# EAGLE schematic regulator_plus_switch_multi (EAGLE 7.2.0)
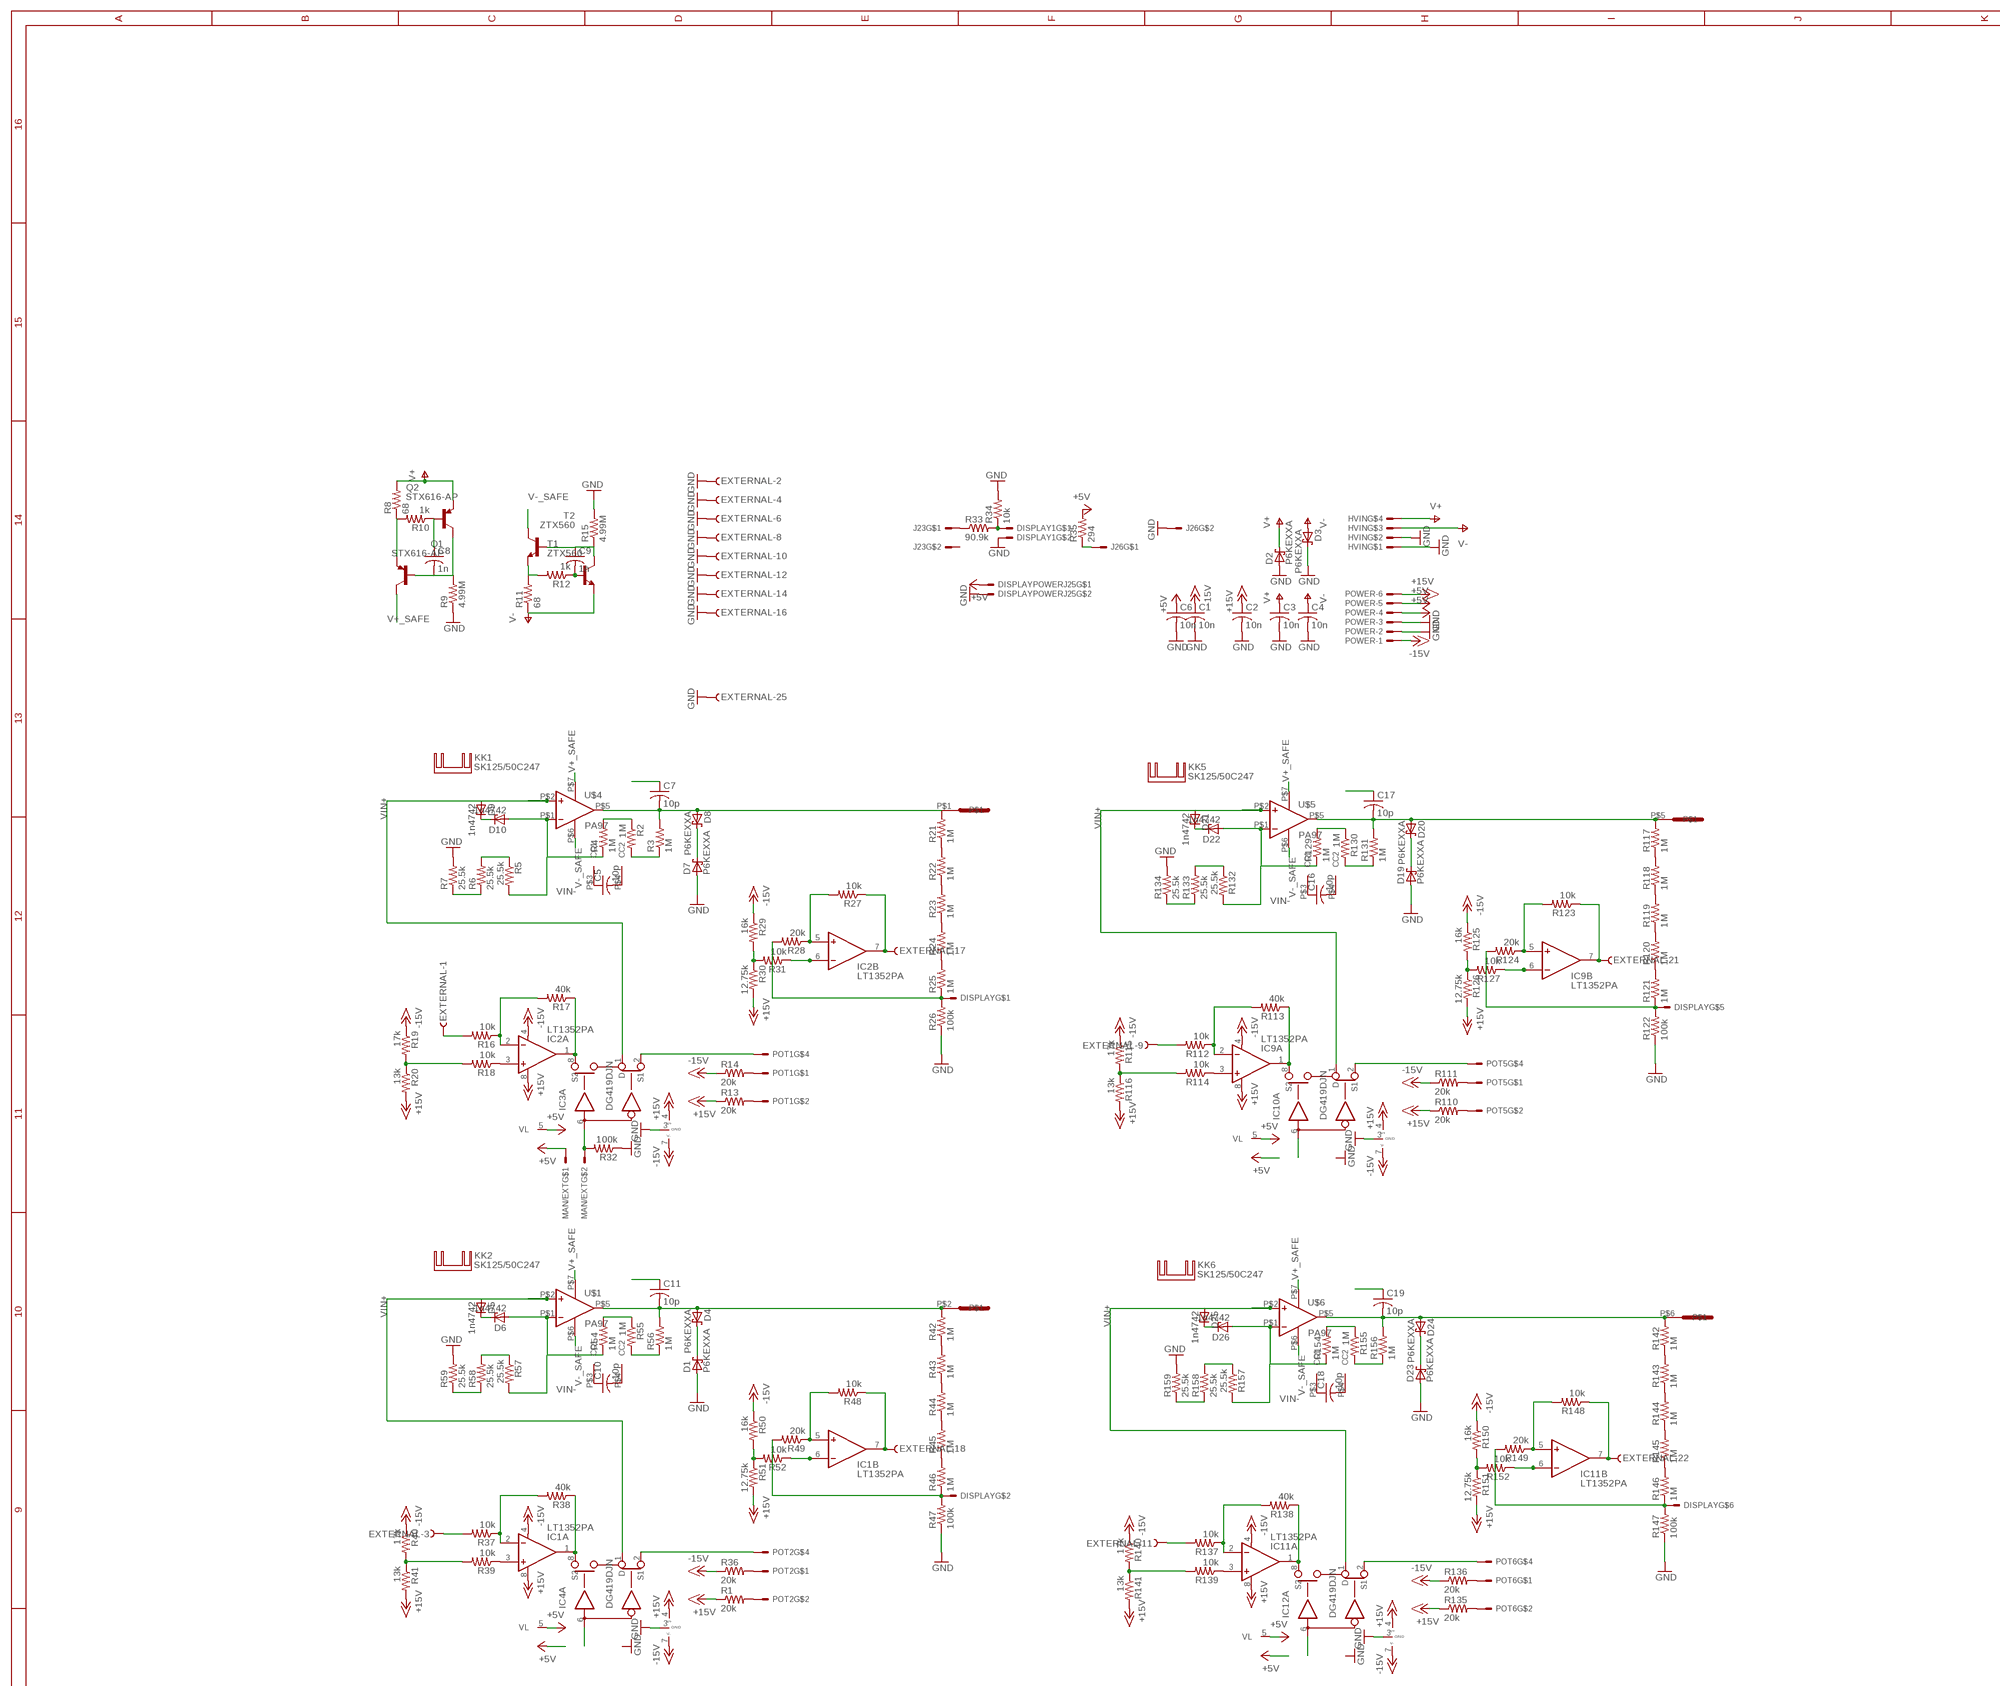
[diagram p0: schematic, sheet 1, part 1 of 2]
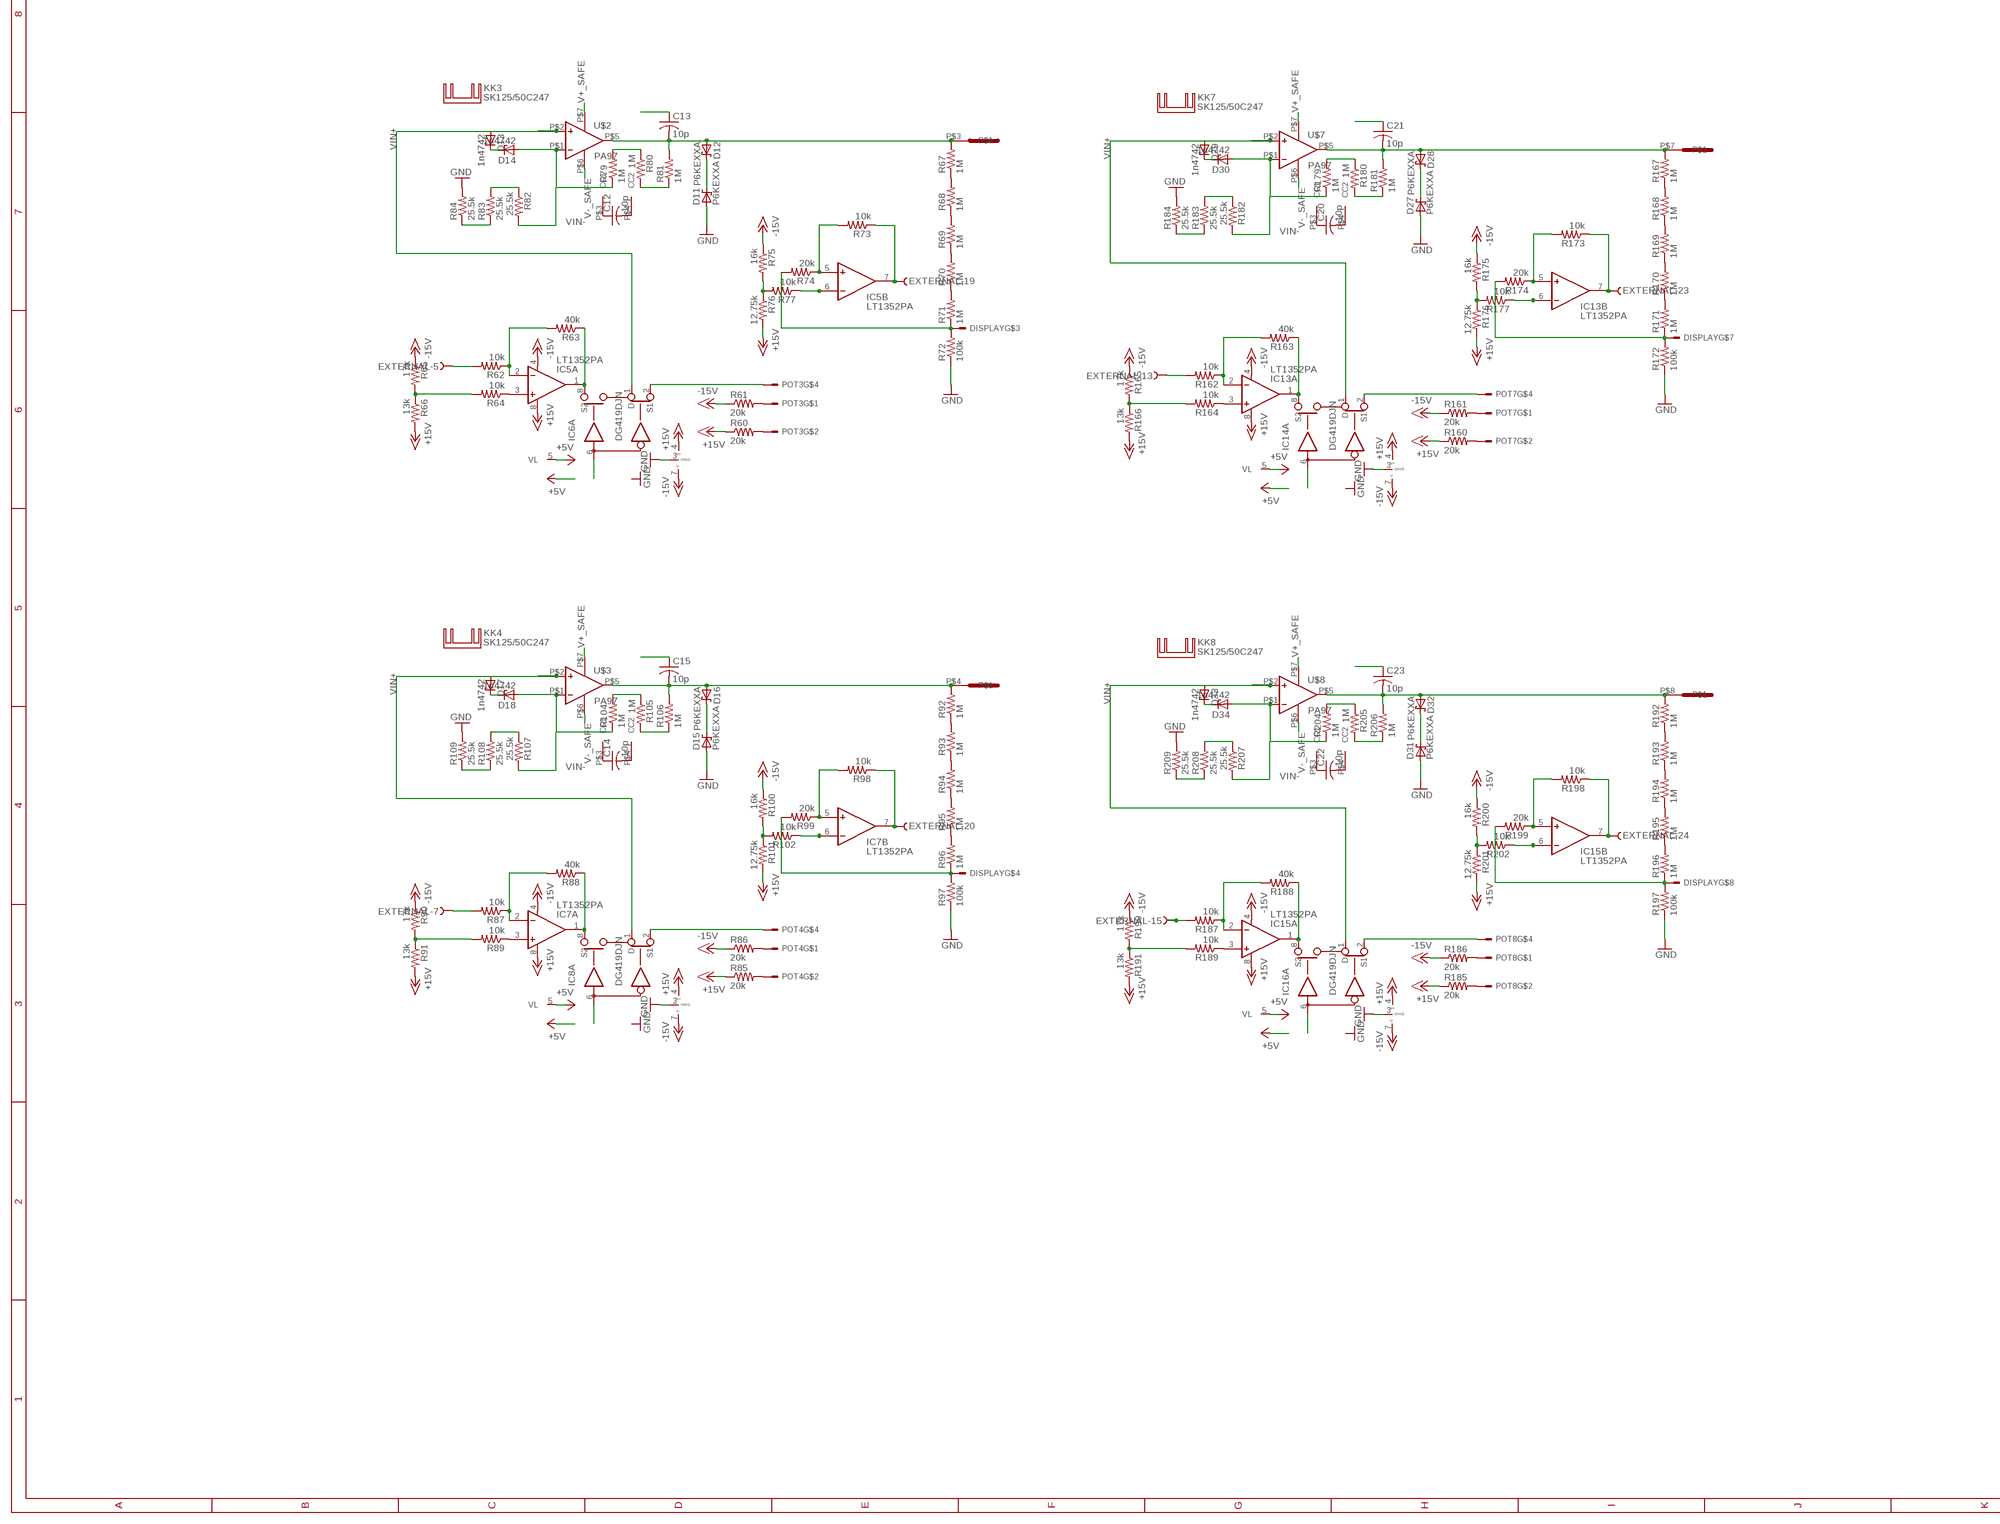
[diagram p1: schematic, sheet 1, part 2 of 2]

## Parts
C1  10n  C-US075-032X103  [C075-032X103]
C2  10n  C-US075-032X103  [C075-032X103]
C3  10n  C-US075-032X103  [C075-032X103]
C4  10n  C-US075-032X103  [C075-032X103]
C5  10p  C-US075-032X103  [C075-032X103]
C6  10n  C-US075-032X103  [C075-032X103]
C7  10p  C-US075-032X103  [C075-032X103]
C8  1n  C-US075-032X103  [C075-032X103]
C9  1n  C-US075-032X103  [C075-032X103]
C10  10p  C-US075-032X103  [C075-032X103]
C11  10p  C-US075-032X103  [C075-032X103]
C12  10p  C-US075-032X103  [C075-032X103]
C13  10p  C-US075-032X103  [C075-032X103]
C14  10p  C-US075-032X103  [C075-032X103]
C15  10p  C-US075-032X103  [C075-032X103]
C16  10p  C-US075-032X103  [C075-032X103]
C17  10p  C-US075-032X103  [C075-032X103]
C18  10p  C-US075-032X103  [C075-032X103]
C19  10p  C-US075-032X103  [C075-032X103]
C20  10p  C-US075-032X103  [C075-032X103]
C21  10p  C-US075-032X103  [C075-032X103]
C22  10p  C-US075-032X103  [C075-032X103]
C23  10p  C-US075-032X103  [C075-032X103]
D1  P6KEXXA  [C1702-15]
D2  P6KEXXA  [C1702-15]
D3  P6KEXXA  [C1702-15]
D4  P6KEXXA  [C1702-15]
D5  1n4742  ZENER-DIODEDO41Z10  [DO41Z10]
D6  1n4742  ZENER-DIODEDO41Z10  [DO41Z10]
D7  P6KEXXA  [C1702-15]
D8  P6KEXXA  [C1702-15]
D9  1n4742  ZENER-DIODEDO41Z10  [DO41Z10]
D10  1n4742  ZENER-DIODEDO41Z10  [DO41Z10]
D11  P6KEXXA  [C1702-15]
D12  P6KEXXA  [C1702-15]
D13  1n4742  ZENER-DIODEDO41Z10  [DO41Z10]
D14  1n4742  ZENER-DIODEDO41Z10  [DO41Z10]
D15  P6KEXXA  [C1702-15]
D16  P6KEXXA  [C1702-15]
D17  1n4742  ZENER-DIODEDO41Z10  [DO41Z10]
D18  1n4742  ZENER-DIODEDO41Z10  [DO41Z10]
D19  P6KEXXA  [C1702-15]
D20  P6KEXXA  [C1702-15]
D21  1n4742  ZENER-DIODEDO41Z10  [DO41Z10]
D22  1n4742  ZENER-DIODEDO41Z10  [DO41Z10]
D23  P6KEXXA  [C1702-15]
D24  P6KEXXA  [C1702-15]
D25  1n4742  ZENER-DIODEDO41Z10  [DO41Z10]
D26  1n4742  ZENER-DIODEDO41Z10  [DO41Z10]
D27  P6KEXXA  [C1702-15]
D28  P6KEXXA  [C1702-15]
D29  1n4742  ZENER-DIODEDO41Z10  [DO41Z10]
D30  1n4742  ZENER-DIODEDO41Z10  [DO41Z10]
D31  P6KEXXA  [C1702-15]
D32  P6KEXXA  [C1702-15]
D33  1n4742  ZENER-DIODEDO41Z10  [DO41Z10]
D34  1n4742  ZENER-DIODEDO41Z10  [DO41Z10]
DISPLAY  5669-8  [5669-8]
DISPLAY1  5569-2  [5569-2]
DISPLAYPOWERJ25  5569-2  [5569-2]
EXTERNAL  F25HPS  [F25HP]
HVIN  5569-4  [5669-4]
IC1  LT1352PA  [DIL08]
IC2  LT1352PA  [DIL08]
IC3  DG419DJN  [DIL08]
IC4  DG419DJN  [DIL08]
IC5  LT1352PA  [DIL08]
IC6  DG419DJN  [DIL08]
IC7  LT1352PA  [DIL08]
IC8  DG419DJN  [DIL08]
IC9  LT1352PA  [DIL08]
IC10  DG419DJN  [DIL08]
IC11  LT1352PA  [DIL08]
IC12  DG419DJN  [DIL08]
IC13  LT1352PA  [DIL08]
IC14  DG419DJN  [DIL08]
IC15  LT1352PA  [DIL08]
IC16  DG419DJN  [DIL08]
J23  5569-2  [5569-2]
J26  5569-2  [5569-2]
KK1  SK125/50C247  [C247-050]
KK2  SK125/50C247  [C247-050]
KK3  SK125/50C247  [C247-050]
KK4  SK125/50C247  [C247-050]
KK5  SK125/50C247  [C247-050]
KK6  SK125/50C247  [C247-050]
KK7  SK125/50C247  [C247-050]
KK8  SK125/50C247  [C247-050]
MAN/EXT  5569-2  [5569-2]
OUT  640584-1  [640584-1]
POT1  5569-4  [5669-4]
POT2  5569-4  [5669-4]
POT3  5569-4  [5669-4]
POT4  5569-4  [5669-4]
POT5  5569-4  [5669-4]
POT6  5569-4  [5669-4]
POT7  5569-4  [5669-4]
POT8  5569-4  [5669-4]
POWER  KK-156-6  [KK-156-6]
Q1  STX616-AP  2N3906  [TO92]
Q2  STX616-AP  2N3906  [TO92]
R1  20k  R-US_0207/10  [0207/10]
R2  1M  R-US_0207/10  [0207/10]
R3  1M  R-US_0207/10  [0207/10]
R4  1M  R-US_0207/10  [0207/10]
R5  25.5k  R-US_0207/10  [0207/10]
R6  25.5k  R-US_0207/10  [0207/10]
R7  25.5k  R-US_0207/10  [0207/10]
R8  68  R-US_0207/10  [0207/10]
R9  4.99M  R-US_0207/10  [0207/10]
R10  1k  R-US_0207/10  [0207/10]
R11  68  R-US_0207/10  [0207/10]
R12  1k  R-US_0207/10  [0207/10]
R13  20k  R-US_0207/10  [0207/10]
R14  20k  R-US_0207/10  [0207/10]
R15  4.99M  R-US_0207/10  [0207/10]
R16  10k  R-US_0207/10  [0207/10]
R17  40k  R-US_0207/10  [0207/10]
R18  10k  R-US_0207/10  [0207/10]
R19  17k  R-US_0207/10  [0207/10]
R20  13k  R-US_0207/10  [0207/10]
R21  1M  R-US_0207/10  [0207/10]
R22  1M  R-US_0207/10  [0207/10]
R23  1M  R-US_0207/10  [0207/10]
R24  1M  R-US_0207/10  [0207/10]
R25  1M  R-US_0207/10  [0207/10]
R26  100k  R-US_0207/10  [0207/10]
R27  10k  R-US_0207/10  [0207/10]
R28  20k  R-US_0207/10  [0207/10]
R29  16k  R-US_0207/10  [0207/10]
R30  12.75k  R-US_0207/10  [0207/10]
R31  10k  R-US_0207/10  [0207/10]
R32  100k  R-US_0207/10  [0207/10]
R33  90.9k  R-US_0207/10  [0207/10]
R34  10k  R-US_0207/10  [0207/10]
R35  294  R-US_0207/10  [0207/10]
R36  20k  R-US_0207/10  [0207/10]
R37  10k  R-US_0207/10  [0207/10]
R38  40k  R-US_0207/10  [0207/10]
R39  10k  R-US_0207/10  [0207/10]
R40  17k  R-US_0207/10  [0207/10]
R41  13k  R-US_0207/10  [0207/10]
R42  1M  R-US_0207/10  [0207/10]
R43  1M  R-US_0207/10  [0207/10]
R44  1M  R-US_0207/10  [0207/10]
R45  1M  R-US_0207/10  [0207/10]
R46  1M  R-US_0207/10  [0207/10]
R47  100k  R-US_0207/10  [0207/10]
R48  10k  R-US_0207/10  [0207/10]
R49  20k  R-US_0207/10  [0207/10]
R50  16k  R-US_0207/10  [0207/10]
R51  12.75k  R-US_0207/10  [0207/10]
R52  10k  R-US_0207/10  [0207/10]
R54  1M  R-US_0207/10  [0207/10]
R55  1M  R-US_0207/10  [0207/10]
R56  1M  R-US_0207/10  [0207/10]
R57  25.5k  R-US_0207/10  [0207/10]
R58  25.5k  R-US_0207/10  [0207/10]
R59  25.5k  R-US_0207/10  [0207/10]
R60  20k  R-US_0207/10  [0207/10]
R61  20k  R-US_0207/10  [0207/10]
R62  10k  R-US_0207/10  [0207/10]
R63  40k  R-US_0207/10  [0207/10]
R64  10k  R-US_0207/10  [0207/10]
R65  17k  R-US_0207/10  [0207/10]
R66  13k  R-US_0207/10  [0207/10]
R67  1M  R-US_0207/10  [0207/10]
R68  1M  R-US_0207/10  [0207/10]
R69  1M  R-US_0207/10  [0207/10]
R70  1M  R-US_0207/10  [0207/10]
R71  1M  R-US_0207/10  [0207/10]
R72  100k  R-US_0207/10  [0207/10]
R73  10k  R-US_0207/10  [0207/10]
R74  20k  R-US_0207/10  [0207/10]
R75  16k  R-US_0207/10  [0207/10]
R76  12.75k  R-US_0207/10  [0207/10]
R77  10k  R-US_0207/10  [0207/10]
R79  1M  R-US_0207/10  [0207/10]
R80  1M  R-US_0207/10  [0207/10]
R81  1M  R-US_0207/10  [0207/10]
R82  25.5k  R-US_0207/10  [0207/10]
R83  25.5k  R-US_0207/10  [0207/10]
R84  25.5k  R-US_0207/10  [0207/10]
R85  20k  R-US_0207/10  [0207/10]
R86  20k  R-US_0207/10  [0207/10]
R87  10k  R-US_0207/10  [0207/10]
R88  40k  R-US_0207/10  [0207/10]
R89  10k  R-US_0207/10  [0207/10]
R90  17k  R-US_0207/10  [0207/10]
R91  13k  R-US_0207/10  [0207/10]
R92  1M  R-US_0207/10  [0207/10]
R93  1M  R-US_0207/10  [0207/10]
R94  1M  R-US_0207/10  [0207/10]
R95  1M  R-US_0207/10  [0207/10]
R96  1M  R-US_0207/10  [0207/10]
R97  100k  R-US_0207/10  [0207/10]
R98  10k  R-US_0207/10  [0207/10]
R99  20k  R-US_0207/10  [0207/10]
R100  16k  R-US_0207/10  [0207/10]
R101  12.75k  R-US_0207/10  [0207/10]
R102  10k  R-US_0207/10  [0207/10]
R104  1M  R-US_0207/10  [0207/10]
R105  1M  R-US_0207/10  [0207/10]
R106  1M  R-US_0207/10  [0207/10]
R107  25.5k  R-US_0207/10  [0207/10]
R108  25.5k  R-US_0207/10  [0207/10]
R109  25.5k  R-US_0207/10  [0207/10]
R110  20k  R-US_0207/10  [0207/10]
R111  20k  R-US_0207/10  [0207/10]
R112  10k  R-US_0207/10  [0207/10]
R113  40k  R-US_0207/10  [0207/10]
R114  10k  R-US_0207/10  [0207/10]
R115  17k  R-US_0207/10  [0207/10]
R116  13k  R-US_0207/10  [0207/10]
R117  1M  R-US_0207/10  [0207/10]
R118  1M  R-US_0207/10  [0207/10]
R119  1M  R-US_0207/10  [0207/10]
R120  1M  R-US_0207/10  [0207/10]
R121  1M  R-US_0207/10  [0207/10]
R122  100k  R-US_0207/10  [0207/10]
R123  10k  R-US_0207/10  [0207/10]
R124  20k  R-US_0207/10  [0207/10]
R125  16k  R-US_0207/10  [0207/10]
R126  12.75k  R-US_0207/10  [0207/10]
R127  10k  R-US_0207/10  [0207/10]
R129  1M  R-US_0207/10  [0207/10]
R130  1M  R-US_0207/10  [0207/10]
R131  1M  R-US_0207/10  [0207/10]
R132  25.5k  R-US_0207/10  [0207/10]
R133  25.5k  R-US_0207/10  [0207/10]
R134  25.5k  R-US_0207/10  [0207/10]
R135  20k  R-US_0207/10  [0207/10]
R136  20k  R-US_0207/10  [0207/10]
R137  10k  R-US_0207/10  [0207/10]
R138  40k  R-US_0207/10  [0207/10]
R139  10k  R-US_0207/10  [0207/10]
R140  17k  R-US_0207/10  [0207/10]
R141  13k  R-US_0207/10  [0207/10]
R142  1M  R-US_0207/10  [0207/10]
R143  1M  R-US_0207/10  [0207/10]
R144  1M  R-US_0207/10  [0207/10]
R145  1M  R-US_0207/10  [0207/10]
R146  1M  R-US_0207/10  [0207/10]
R147  100k  R-US_0207/10  [0207/10]
R148  10k  R-US_0207/10  [0207/10]
R149  20k  R-US_0207/10  [0207/10]
R150  16k  R-US_0207/10  [0207/10]
R151  12.75k  R-US_0207/10  [0207/10]
R152  10k  R-US_0207/10  [0207/10]
R154  1M  R-US_0207/10  [0207/10]
R155  1M  R-US_0207/10  [0207/10]
R156  1M  R-US_0207/10  [0207/10]
R157  25.5k  R-US_0207/10  [0207/10]
R158  25.5k  R-US_0207/10  [0207/10]
R159  25.5k  R-US_0207/10  [0207/10]
R160  20k  R-US_0207/10  [0207/10]
R161  20k  R-US_0207/10  [0207/10]
R162  10k  R-US_0207/10  [0207/10]
R163  40k  R-US_0207/10  [0207/10]
R164  10k  R-US_0207/10  [0207/10]
R165  17k  R-US_0207/10  [0207/10]
R166  13k  R-US_0207/10  [0207/10]
R167  1M  R-US_0207/10  [0207/10]
R168  1M  R-US_0207/10  [0207/10]
R169  1M  R-US_0207/10  [0207/10]
R170  1M  R-US_0207/10  [0207/10]
R171  1M  R-US_0207/10  [0207/10]
R172  100k  R-US_0207/10  [0207/10]
R173  10k  R-US_0207/10  [0207/10]
R174  20k  R-US_0207/10  [0207/10]
R175  16k  R-US_0207/10  [0207/10]
R176  12.75k  R-US_0207/10  [0207/10]
R177  10k  R-US_0207/10  [0207/10]
R179  1M  R-US_0207/10  [0207/10]
R180  1M  R-US_0207/10  [0207/10]
R181  1M  R-US_0207/10  [0207/10]
R182  25.5k  R-US_0207/10  [0207/10]
R183  25.5k  R-US_0207/10  [0207/10]
R184  25.5k  R-US_0207/10  [0207/10]
R185  20k  R-US_0207/10  [0207/10]
R186  20k  R-US_0207/10  [0207/10]
R187  10k  R-US_0207/10  [0207/10]
R188  40k  R-US_0207/10  [0207/10]
R189  10k  R-US_0207/10  [0207/10]
R190  17k  R-US_0207/10  [0207/10]
R191  13k  R-US_0207/10  [0207/10]
R192  1M  R-US_0207/10  [0207/10]
R193  1M  R-US_0207/10  [0207/10]
R194  1M  R-US_0207/10  [0207/10]
R195  1M  R-US_0207/10  [0207/10]
R196  1M  R-US_0207/10  [0207/10]
R197  100k  R-US_0207/10  [0207/10]
R198  10k  R-US_0207/10  [0207/10]
R199  20k  R-US_0207/10  [0207/10]
R200  16k  R-US_0207/10  [0207/10]
R201  12.75k  R-US_0207/10  [0207/10]
R202  10k  R-US_0207/10  [0207/10]
R204  1M  R-US_0207/10  [0207/10]
R205  1M  R-US_0207/10  [0207/10]
R206  1M  R-US_0207/10  [0207/10]
R207  25.5k  R-US_0207/10  [0207/10]
R208  25.5k  R-US_0207/10  [0207/10]
R209  25.5k  R-US_0207/10  [0207/10]
T1  ZTX560  2N3904  [TO92]
T2  ZTX560  2N3904  [TO92]
U$1  PA97  [7SIP]
U$2  PA97  [7SIP]
U$3  PA97  [7SIP]
U$4  PA97  [7SIP]
U$5  PA97  [7SIP]
U$6  PA97  [7SIP]
U$7  PA97  [7SIP]
U$8  PA97  [7SIP]

## Nets
+5V [power]: C6.1 DISPLAYPOWERJ25.P$1 IC3.5(VL:VL) IC4.5(VL:VL) IC6.5(VL:VL) IC8.5(VL:VL) IC10.5(VL:VL) IC12.5(VL:VL) IC14.5(VL:VL) IC16.5(VL:VL) MAN/EXT.P$1 POWER.4 POWER.5 R35.2
+15V [power]: C2.1 IC1.8(A:V+) IC2.8(A:V+) IC3.4(P:V+) IC4.4(P:V+) IC5.8(A:V+) IC6.4(P:V+) IC7.8(A:V+) IC8.4(P:V+) IC9.8(A:V+) IC10.4(P:V+) IC11.8(A:V+) IC12.4(P:V+) IC13.8(A:V+) IC14.4(P:V+) IC15.8(A:V+) IC16.4(P:V+) POWER.6 R1.1 R13.1 R20.2 R30.2 R41.2 R51.2 R60.1 R66.2 R76.2 R85.1 R91.2 R101.2 R110.1 R116.2 R126.2 R135.1 R141.2 R151.2 R160.1 R166.2 R176.2 R185.1 R191.2 R201.2
-15V [power]: C1.1 IC1.4(A:V-) IC2.4(A:V-) IC3.7(P:V-) IC4.7(P:V-) IC5.4(A:V-) IC6.7(P:V-) IC7.4(A:V-) IC8.7(P:V-) IC9.4(A:V-) IC10.7(P:V-) IC11.4(A:V-) IC12.7(P:V-) IC13.4(A:V-) IC14.7(P:V-) IC15.4(A:V-) IC16.7(P:V-) POWER.1 R14.1 R19.1 R29.1 R36.1 R40.1 R50.1 R61.1 R65.1 R75.1 R86.1 R90.1 R100.1 R111.1 R115.1 R125.1 R136.1 R140.1 R150.1 R161.1 R165.1 R175.1 R186.1 R190.1 R200.1
CMD1: EXTERNAL.1 R16.2
CMD2: EXTERNAL.3 R37.2
CMD3: EXTERNAL.5 R62.2
CMD4: EXTERNAL.7 R87.2
CMD5: EXTERNAL.9 R112.2
CMD6: EXTERNAL.11 R137.2
CMD7: EXTERNAL.13 R162.2
CMD8: EXTERNAL.15 R187.2
GND [ground]: C1.2 C2.2 C3.2 C4.2 C6.2 D1.A D2.A D3.C D7.A D11.A D15.A D19.A D23.A D27.A D31.A DISPLAY1.P$2 DISPLAYPOWERJ25.P$2 EXTERNAL.2 EXTERNAL.4 EXTERNAL.6 EXTERNAL.8 EXTERNAL.10 EXTERNAL.12 EXTERNAL.14 EXTERNAL.16 EXTERNAL.25 HVIN.P$1 HVIN.P$2 IC3.3(P:GND) IC4.3(P:GND) IC6.3(P:GND) IC8.3(P:GND) IC10.3(P:GND) IC12.3(P:GND) IC14.3(P:GND) IC16.3(P:GND) J26.P$2 POWER.2 POWER.3 R7.2 R9.1 R15.2 R26.1 R32.1 R34.2 R47.1 R59.2 R72.1 R84.2 R97.1 R109.2 R122.1 R134.2 R147.1 R159.2 R172.1 R184.2 R197.1 R209.2
MAN: IC3.6(A:IN) IC4.6(A:IN) IC6.6(A:IN) IC8.6(A:IN) IC10.6(A:IN) IC12.6(A:IN) IC14.6(A:IN) IC16.6(A:IN) MAN/EXT.P$2 R32.2
N$1: R11.2 R12.2 T2.3(E)
N$2: C8.1 Q2.2(B) R10.1
N$3: C5.1 U$4.P$3(CC1)
N$4: C5.2 U$4.P$4(CC2)
N$5: Q1.3(E) R8.1 R10.2
N$6: IC1.2(A:-IN) R37.1 R38.2
N$7: IC1.3(A:+IN) R39.1
N$8: D7.C D8.C
N$9: POT1.P$2 R13.2
N$10: C8.2 Q1.2(B) Q2.1(C) R9.2
N$11 [power]: C7.2 D8.A OUT.P$1 R3.2 R21.2 U$4.P$5(OUT)
N$12: R2.1 R4.2
N$13: IC3.2(A:S1) POT1.P$4
N$14: R5.1 R6.2
N$15: POT1.P$1 R14.2
N$16: R6.1 R7.1
N$17: C9.2 R12.1 T1.2(B)
N$18: R2.2 R3.1
N$19: C9.1 R15.1 T1.1(C) T2.2(B)
N$20: DISPLAY1.P$1 R33.2 R34.1
N$21: J23.P$1 R33.1
N$22: J26.P$1 R35.1
N$23: R39.2 R40.2 R41.1
N$24: IC2.2(A:-IN) R16.1 R17.2
N$25: IC2.3(A:+IN) R18.1
N$26: R18.2 R19.2 R20.1
N$27: IC2.1(A:OUT) IC3.8(A:S2) R17.1
N$28: IC1.1(A:OUT) IC4.8(A:S2) R38.1
N$29: D9.C D10.C
N$30: R21.1 R22.2
N$31: R22.1 R23.2
N$32: R23.1 R24.2
N$33: R24.1 R25.2
N$34: DISPLAY.P$1 R25.1 R26.2 R28.2
N$35: EXTERNAL.17 IC2.7(B:OUT) R27.1
N$36: R29.2 R30.1 R31.2
N$37: IC2.6(B:-IN) R31.1
N$38: R42.1 R43.2
N$39: IC2.5(B:+IN) R27.2 R28.1
N$40: R43.1 R44.2
N$41: R44.1 R45.2
N$42: R45.1 R46.2
N$43: DISPLAY.P$2 R46.1 R47.2 R49.2
N$44: EXTERNAL.18 IC1.7(B:OUT) R48.1
N$45: R50.2 R51.1 R52.2
N$46: IC1.6(B:-IN) R52.1
N$47: IC1.5(B:+IN) R48.2 R49.1
N$48: POT2.P$2 R1.2
N$49: IC4.2(A:S1) POT2.P$4
N$50: POT2.P$1 R36.2
N$51: C10.1 U$1.P$3(CC1)
N$52: C10.2 U$1.P$4(CC2)
N$53 [power]: C11.2 D4.A OUT.P$2 R42.2 R56.2 U$1.P$5(OUT)
N$54: D1.C D4.C
N$55: R54.2 R55.1
N$56: R57.1 R58.2
N$57: R58.1 R59.1
N$58: R55.2 R56.1
N$59: D5.C D6.C
N$60: IC5.2(A:-IN) R62.1 R63.2
N$61: IC5.3(A:+IN) R64.1
N$62: R64.2 R65.2 R66.1
N$63: IC5.1(A:OUT) IC6.8(A:S2) R63.1
N$64: R67.1 R68.2
N$65: R68.1 R69.2
N$66: R69.1 R70.2
N$67: R70.1 R71.2
N$68: DISPLAY.P$3 R71.1 R72.2 R74.2
N$69: EXTERNAL.19 IC5.7(B:OUT) R73.1
N$70: R75.2 R76.1 R77.2
N$71: IC5.6(B:-IN) R77.1
N$72: IC5.5(B:+IN) R73.2 R74.1
N$73: POT3.P$2 R60.2
N$74: IC6.2(A:S1) POT3.P$4
N$75: POT3.P$1 R61.2
N$76: C12.1 U$2.P$3(CC1)
N$77: C12.2 U$2.P$4(CC2)
N$78 [power]: C13.2 D12.A OUT.P$3 R67.2 R81.2 U$2.P$5(OUT)
N$79: D11.C D12.C
N$80: R79.2 R80.1
N$81: R82.1 R83.2
N$82: R83.1 R84.1
N$83: R80.2 R81.1
N$84: D13.C D14.C
N$85: IC7.2(A:-IN) R87.1 R88.2
N$86: IC7.3(A:+IN) R89.1
N$87: R89.2 R90.2 R91.1
N$88: IC7.1(A:OUT) IC8.8(A:S2) R88.1
N$89: R92.1 R93.2
N$90: R93.1 R94.2
N$91: R94.1 R95.2
N$92: R95.1 R96.2
N$93: DISPLAY.P$4 R96.1 R97.2 R99.2
N$94: EXTERNAL.20 IC7.7(B:OUT) R98.1
N$95: R100.2 R101.1 R102.2
N$96: IC7.6(B:-IN) R102.1
N$97: IC7.5(B:+IN) R98.2 R99.1
N$98: POT4.P$2 R85.2
N$99: IC8.2(A:S1) POT4.P$4
N$100: POT4.P$1 R86.2
N$101: C14.1 U$3.P$3(CC1)
N$102: C14.2 U$3.P$4(CC2)
N$103 [power]: C15.2 D16.A OUT.P$4 R92.2 R106.2 U$3.P$5(OUT)
N$104: D15.C D16.C
N$105: R104.2 R105.1
N$106: R107.1 R108.2
N$107: R108.1 R109.1
N$108: R105.2 R106.1
N$109: D17.C D18.C
N$110: IC9.2(A:-IN) R112.1 R113.2
N$111: IC9.3(A:+IN) R114.1
N$112: R114.2 R115.2 R116.1
N$113: IC9.1(A:OUT) IC10.8(A:S2) R113.1
N$114: R117.1 R118.2
N$115: R118.1 R119.2
N$116: R119.1 R120.2
N$117: R120.1 R121.2
N$118: DISPLAY.P$5 R121.1 R122.2 R124.2
N$119: EXTERNAL.21 IC9.7(B:OUT) R123.1
N$120: R125.2 R126.1 R127.2
N$121: IC9.6(B:-IN) R127.1
N$122: IC9.5(B:+IN) R123.2 R124.1
N$123: POT5.P$2 R110.2
N$124: IC10.2(A:S1) POT5.P$4
N$125: POT5.P$1 R111.2
N$126: C16.1 U$5.P$3(CC1)
N$127: C16.2 U$5.P$4(CC2)
N$128 [power]: C17.2 D20.A OUT.P$5 R117.2 R131.2 U$5.P$5(OUT)
N$129: D19.C D20.C
N$130: R129.2 R130.1
N$131: R132.1 R133.2
N$132: R133.1 R134.1
N$133: R130.2 R131.1
N$134: D21.C D22.C
N$135: IC11.2(A:-IN) R137.1 R138.2
N$136: IC11.3(A:+IN) R139.1
N$137: R139.2 R140.2 R141.1
N$138: IC11.1(A:OUT) IC12.8(A:S2) R138.1
N$139: R142.1 R143.2
N$140: R143.1 R144.2
N$141: R144.1 R145.2
N$142: R145.1 R146.2
N$143: DISPLAY.P$6 R146.1 R147.2 R149.2
N$144: EXTERNAL.22 IC11.7(B:OUT) R148.1
N$145: R150.2 R151.1 R152.2
N$146: IC11.6(B:-IN) R152.1
N$147: IC11.5(B:+IN) R148.2 R149.1
N$148: POT6.P$2 R135.2
N$149: IC12.2(A:S1) POT6.P$4
N$150: POT6.P$1 R136.2
N$151: C18.1 U$6.P$3(CC1)
N$152: C18.2 U$6.P$4(CC2)
N$153 [power]: C19.2 D24.A OUT.P$6 R142.2 R156.2 U$6.P$5(OUT)
N$154: D23.C D24.C
N$155: R154.2 R155.1
N$156: R157.1 R158.2
N$157: R158.1 R159.1
N$158: R155.2 R156.1
N$159: D25.C D26.C
N$160: IC13.2(A:-IN) R162.1 R163.2
N$161: IC13.3(A:+IN) R164.1
N$162: R164.2 R165.2 R166.1
N$163: IC13.1(A:OUT) IC14.8(A:S2) R163.1
N$164: R167.1 R168.2
N$165: R168.1 R169.2
N$166: R169.1 R170.2
N$167: R170.1 R171.2
N$168: DISPLAY.P$7 R171.1 R172.2 R174.2
N$169: EXTERNAL.23 IC13.7(B:OUT) R173.1
N$170: R175.2 R176.1 R177.2
N$171: IC13.6(B:-IN) R177.1
N$172: IC13.5(B:+IN) R173.2 R174.1
N$173: POT7.P$2 R160.2
N$174: IC14.2(A:S1) POT7.P$4
N$175: POT7.P$1 R161.2
N$176: C20.1 U$7.P$3(CC1)
N$177: C20.2 U$7.P$4(CC2)
N$178 [power]: C21.2 D28.A OUT.P$7 R167.2 R181.2 U$7.P$5(OUT)
N$179: D27.C D28.C
N$180: R179.2 R180.1
N$181: R182.1 R183.2
N$182: R183.1 R184.1
N$183: R180.2 R181.1
N$184: D29.C D30.C
N$185: IC15.2(A:-IN) R187.1 R188.2
N$186: IC15.3(A:+IN) R189.1
N$187: R189.2 R190.2 R191.1
N$188: IC15.1(A:OUT) IC16.8(A:S2) R188.1
N$189: R192.1 R193.2
N$190: R193.1 R194.2
N$191: R194.1 R195.2
N$192: R195.1 R196.2
N$193: DISPLAY.P$8 R196.1 R197.2 R199.2
N$194: EXTERNAL.24 IC15.7(B:OUT) R198.1
N$195: R200.2 R201.1 R202.2
N$196: IC15.6(B:-IN) R202.1
N$197: IC15.5(B:+IN) R198.2 R199.1
N$198: POT8.P$2 R185.2
N$199: IC16.2(A:S1) POT8.P$4
N$200: POT8.P$1 R186.2
N$201: C22.1 U$8.P$3(CC1)
N$202: C22.2 U$8.P$4(CC2)
N$203 [power]: C23.2 D32.A OUT.P$8 R192.2 R206.2 U$8.P$5(OUT)
N$204: D31.C D32.C
N$205: R204.2 R205.1
N$206: R207.1 R208.2
N$207: R208.1 R209.1
N$208: R205.2 R206.1
N$209: D33.C D34.C
V+ [power]: C3.1 D2.C HVIN.P$4 Q2.3(E) R8.2
V+_SAFE [power]: Q1.1(C) U$1.P$7(V+) U$2.P$7(V+) U$3.P$7(V+) U$4.P$7(V+) U$5.P$7(V+) U$6.P$7(V+) U$7.P$7(V+) U$8.P$7(V+)
V- [power]: C4.1 D3.A HVIN.P$3 R11.1 T1.3(E)
V-_SAFE [power]: T2.1(C) U$1.P$6(V-) U$2.P$6(V-) U$3.P$6(V-) U$4.P$6(V-) U$5.P$6(V-) U$6.P$6(V-) U$7.P$6(V-) U$8.P$6(V-)
VIN+: D5.A D9.A D13.A D17.A D21.A D25.A D29.A D33.A IC3.1(A:D) IC4.1(A:D) IC6.1(A:D) IC8.1(A:D) IC10.1(A:D) IC12.1(A:D) IC14.1(A:D) IC16.1(A:D) U$1.P$2(+IN) U$2.P$2(+IN) U$3.P$2(+IN) U$4.P$2(+IN) U$5.P$2(+IN) U$6.P$2(+IN) U$7.P$2(+IN) U$8.P$2(+IN)
VIN-: C7.1 C11.1 C13.1 C15.1 C17.1 C19.1 C21.1 C23.1 D6.A D10.A D14.A D18.A D22.A D26.A D30.A D34.A R4.1 R5.2 R54.1 R57.2 R79.1 R82.2 R104.1 R107.2 R129.1 R132.2 R154.1 R157.2 R179.1 R182.2 R204.1 R207.2 U$1.P$1(-IN) U$2.P$1(-IN) U$3.P$1(-IN) U$4.P$1(-IN) U$5.P$1(-IN) U$6.P$1(-IN) U$7.P$1(-IN) U$8.P$1(-IN)
Unconnected: J23.P$2 POT1.P$3 POT2.P$3 POT3.P$3 POT4.P$3 POT5.P$3 POT6.P$3 POT7.P$3 POT8.P$3

## Library data of the parts
C1-C23 = rcl:C-US: CAPACITOR, American symbol
D1-D4 D7 D8 D11 D12 D15 D16 D19 D20 D23 D24 D27 D28 D31 D32 = diode:P6KEXXA: DIODE transient-voltage suppressor
D5 D6 D9 D10 D13 D14 D17 D18 D21 D22 D25 D26 D29 D30 D33 D34 = diode:ZENER-DIODE: Z-Diode
DISPLAY = con-molex:5669-8
DISPLAY1 DISPLAYPOWERJ25 J23 J26 MAN/EXT = con-molex:5569-2
EXTERNAL = con-subd:F25?S: SUB-D; OC_FARNELL: unknown; OC_NEWARK: unknown
HVIN POT1-POT8 = con-molex:5569-4
IC1 IC2 IC5 IC7 IC9 IC11 IC13 IC15 = linear-technology:LT1352: Dual Operational Amplifiers Source: http://datasheets.maxim-ic.com/en/ds/ICL7612-ICL764X.pdf; OC_FARNELL: unknown; OC_NEWARK: unknown
IC3 IC4 IC6 IC8 IC10 IC12 IC14 IC16 = linear:DG419DJ: CMOS SWITCH
KK1-KK8 = heatsink:SK125/50: HEATSINK manufacturer Fischer/distributor Buerklin
OUT = con-amp-te:640584-1
POWER = con-molex:KK-156-6: KK 156 HEADER Source: http://www.molex.com/pdm_docs/sd/026604100_sd.pdf; OC_FARNELL: unknown; OC_NEWARK: unknown
Q1 Q2 = transistor-pnp:2N3906: PNP Transistor
R1-R20 R26-R41 R47-R52 R54-R66 R72-R77 R79-R91 R97-R102 R104-R116 R122-R127 R129-R141 R147-R152 R154-R166 R172-R177 R179-R191 R197-R202 R204-R209 = rcl:R-US_: RESISTOR, American symbol
R21-R25 R42-R46 R67-R71 R92-R96 R117-R121 R142-R146 R167-R171 R192-R196 = resistor:R-US_: RESISTOR, American symbol
T1 T2 = transistor:2N3904: NPN TRANSISTOR
U$1-U$8 = apex:PA97

## Net classes
0 default: width 0.61 mm, clearance 0.254 mm
1 ground: width 0.61 mm, clearance 0.254 mm
2 power: width 1.016 mm, clearance 0.254 mm